# Altium schematic sheet MemWriteController.SchDoc
size A4; DocumentNumber: 8; SheetNumber: 8; SheetTotal: 10
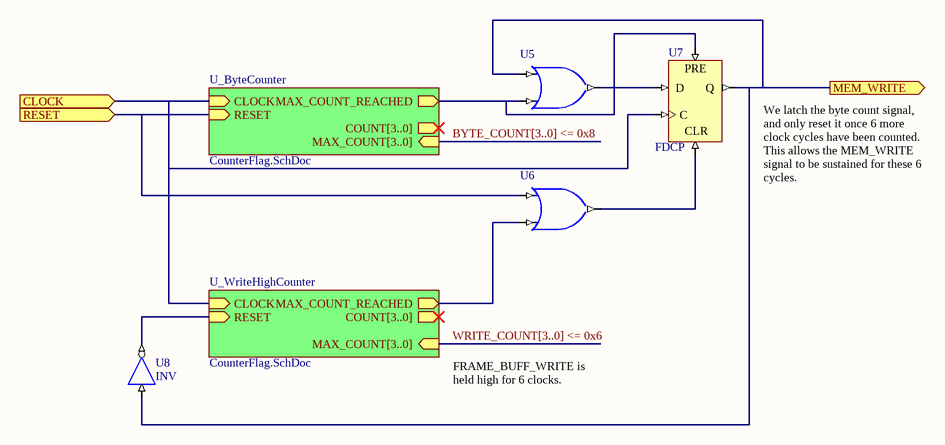
[diagram p0: MemWriteController.SchDoc]

## Parts
U5  OR2S  (value not drawn)
U6  OR2S  (value not drawn)
U7  FDCP
U8  INV

## Sub-sheets
U_ByteCounter = CounterFlag.SchDoc: CLOCK (in), RESET (in), MAX_COUNT_REACHED (out), COUNT[3..0] (out), MAX_COUNT[3..0] (in)
U_WriteHighCounter = CounterFlag.SchDoc: CLOCK (in), RESET (in), MAX_COUNT_REACHED (out), COUNT[3..0] (out), MAX_COUNT[3..0] (in)

## Ports
CLOCK (in), MEM_WRITE (out), RESET (in)

## Nets
CLOCK: U7.C ; port CLOCK, sheet U_ByteCounter/CLOCK, sheet U_WriteHighCounter/CLOCK
MEM_WRITE: U5.I0 U7.Q U8.I ; port MEM_WRITE
RESET: U6.I0 ; port RESET, sheet U_ByteCounter/RESET
NetU5_I1: U5.I1 U7.PRE ; sheet U_ByteCounter/MAX_COUNT_REACHED
NetU5_O: U5.O U7.D
NetU6_I1: U6.I1 ; sheet U_WriteHighCounter/MAX_COUNT_REACHED
NetU6_O: U6.O U7.CLR
NetU8_O: U8.O ; sheet U_WriteHighCounter/RESET

## Buses and harness runs
bus BYTE_COUNT[3..0] <= 0x8 = sheet U_ByteCounter/MAX_COUNT[3..0]
bus WRITE_COUNT[3..0] <= 0x6 = sheet U_WriteHighCounter/MAX_COUNT[3..0]

## Notes on the sheet
- (near U7) We latch the byte count signal, and only reset it once 6 more clock cycles have been counted.
  This allows the MEM_WRITE signal to be sustained for these 6 cycles.
- FRAME_BUFF_WRITE is held high for 6 clocks.

## Library data of the parts
U5 U6 = OR2S: 2-Input OR Gate, Single Pin Version; Xilinx Equivalent: OR2; ArchiveName: GENERIC; VHDLIB_SIM: GENERIC_LIB; Published: 29-Jan-2004; Publisher: Altium Limited; Core Revision: 1.00.00
U7 = FDCP: D-Type Flip-Flop with Asynchronous Preset and Clear; ArchiveName: GENERIC; VHDLIB_SIM: GENERIC_LIB; Published: 29-Jan-2004; Publisher: Altium Limited; Xilinx Equivalent: FDCP; Core Revision: 1.00.00
U8 = INV: Inverter; ArchiveName: GENERIC; VHDLIB_SIM: GENERIC_LIB; Published: 29-Jan-2004; Publisher: Altium Limited; Xilinx Equivalent: INV; Core Revision: 1.00.00